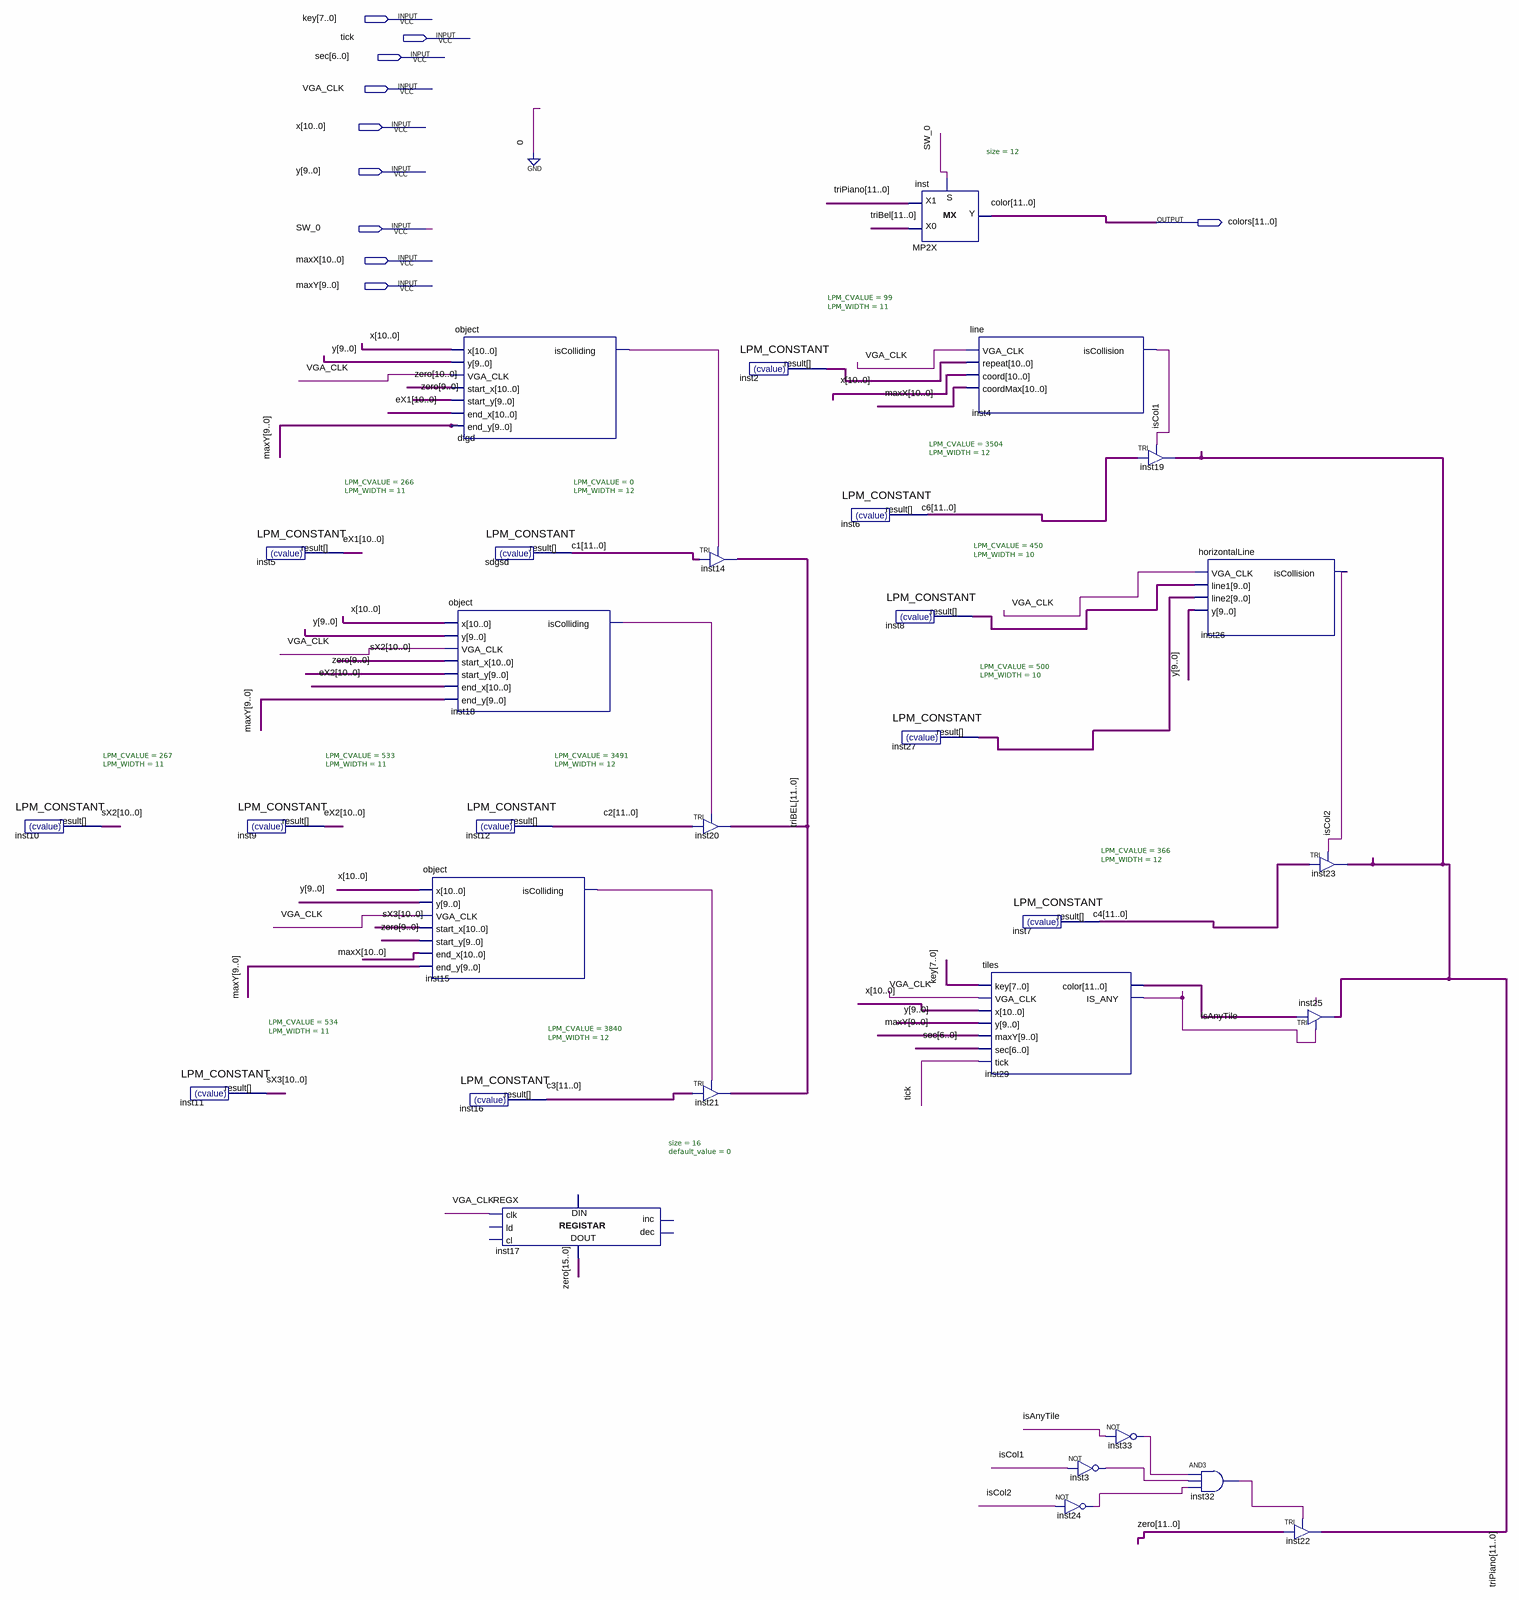
[diagram p0: schematic sheet]
// Quartus schematic objectManagement.bdf as structural Verilog: 31 symbols, 10 pins
module objectManagement (
  input  [7:0] key,
  input  tick,
  input  [6:0] sec,
  input  VGA_CLK,
  input  [10:0] x,
  input  [9:0] y,
  input  SW_0,
  input  [10:0] maxX,
  input  [9:0] maxY,
  output [11:0] colors
);

  wire dfgd_iscolliding, inst3_out, inst15_iscolliding, inst18_iscolliding, inst24_out, inst32_out,
       inst33_out, isAnyTile, isCol1, isCol2;
  wire [9:0] inst8_result, inst27_result;
  wire [10:0] eX1, eX2, inst2_result, sX2, sX3;
  wire [11:0] c1, c2, c3, c4, c6, inst29_color, triBEL, triPiano;
  wire [15:0] zero;

  LPM_CONSTANT #(.LPM_CVALUE(267), .LPM_WIDTH(11)) inst10 (.result(sX2));
  LPM_CONSTANT #(.LPM_CVALUE(534), .LPM_WIDTH(11)) inst11 (.result(sX3));
  LPM_CONSTANT #(.LPM_CVALUE(266), .LPM_WIDTH(11)) inst5 (.result(eX1));
  LPM_CONSTANT #(.LPM_CVALUE(533), .LPM_WIDTH(11)) inst9 (.result(eX2));
  object inst15 (
    .x(x), .y(y), .VGA_CLK(VGA_CLK), .start_x(sX3), .start_y(zero[9:0]), .end_x(maxX), .end_y(maxY),
    .isColliding(inst15_iscolliding));
  object dfgd (
    .x(x), .y(y), .VGA_CLK(VGA_CLK), .start_x(zero[10:0]), .start_y(zero[9:0]), .end_x(eX1), .end_y(maxY),
    .isColliding(dfgd_iscolliding));
  object inst18 (
    .x(x), .y(y), .VGA_CLK(VGA_CLK), .start_x(sX2), .start_y(zero[9:0]), .end_x(eX2), .end_y(maxY),
    .isColliding(inst18_iscolliding));
  LPM_CONSTANT #(.LPM_CVALUE(3491), .LPM_WIDTH(12)) inst12 (.result(c2));
  LPM_CONSTANT #(.LPM_CVALUE(3840), .LPM_WIDTH(12)) inst16 (.result(c3));
  LPM_CONSTANT #(.LPM_CVALUE(0), .LPM_WIDTH(12)) sdgsd (.result(c1));
  REGX #(.size(16), .default_value(0)) inst17 (.clk(VGA_CLK), .data_out(zero));  // open: ld, cl, inc, dec, data_in
  TRI inst14[11:0] (.IN(c1), .OE(dfgd_iscolliding), .OUT(triBEL));
  TRI inst20[11:0] (.IN(c2), .OE(inst18_iscolliding), .OUT(triBEL));
  TRI inst21[11:0] (.IN(c3), .OE(inst15_iscolliding), .OUT(triBEL));
  LPM_CONSTANT #(.LPM_CVALUE(99), .LPM_WIDTH(11)) inst2 (.result(inst2_result));
  LPM_CONSTANT #(.LPM_CVALUE(3504), .LPM_WIDTH(12)) inst6 (.result(c6));
  LPM_CONSTANT #(.LPM_CVALUE(450), .LPM_WIDTH(10)) inst8 (.result(inst8_result));
  MP2X #(.size(12)) inst (.S(SW_0), .X0(triBEL), .X1(triPiano), .Y(colors));
  LPM_CONSTANT #(.LPM_CVALUE(500), .LPM_WIDTH(10)) inst27 (.result(inst27_result));
  line inst4 (.VGA_CLK(VGA_CLK), .\repeat (inst2_result), .coord(x), .coordMax(maxX), .isCollision(isCol1));
  tiles inst29 (
    .key(key), .VGA_CLK(VGA_CLK), .x(x), .y(y), .maxY(maxY), .sec(sec), .tick(tick), .color(inst29_color),
    .IS_ANY(isAnyTile));
  LPM_CONSTANT #(.LPM_CVALUE(366), .LPM_WIDTH(12)) inst7 (.result(c4));
  not inst3 (inst3_out, isCol1);
  not inst24 (inst24_out, isCol2);
  TRI inst19[11:0] (.IN(c6), .OE(isCol1), .OUT(triPiano));
  not inst33 (inst33_out, isAnyTile);
  and inst32 (inst32_out, inst33_out, inst3_out, inst24_out);
  horizontalLine inst26 (.VGA_CLK(VGA_CLK), .line1(inst8_result), .line2(inst27_result), .y(y), .isCollision(isCol2));
  TRI inst22[11:0] (.IN(zero[11:0]), .OE(inst32_out), .OUT(triPiano));
  TRI inst23[11:0] (.IN(c4), .OE(isCol2), .OUT(triPiano));
  TRI inst25[11:0] (.IN(inst29_color), .OE(isAnyTile), .OUT(triPiano));

  // Other names for the same wires on the sheet: color[11:0] = colors
endmodule
